# EAGLE design WMF Ambient SmartPot (EAGLE 9.5.1)
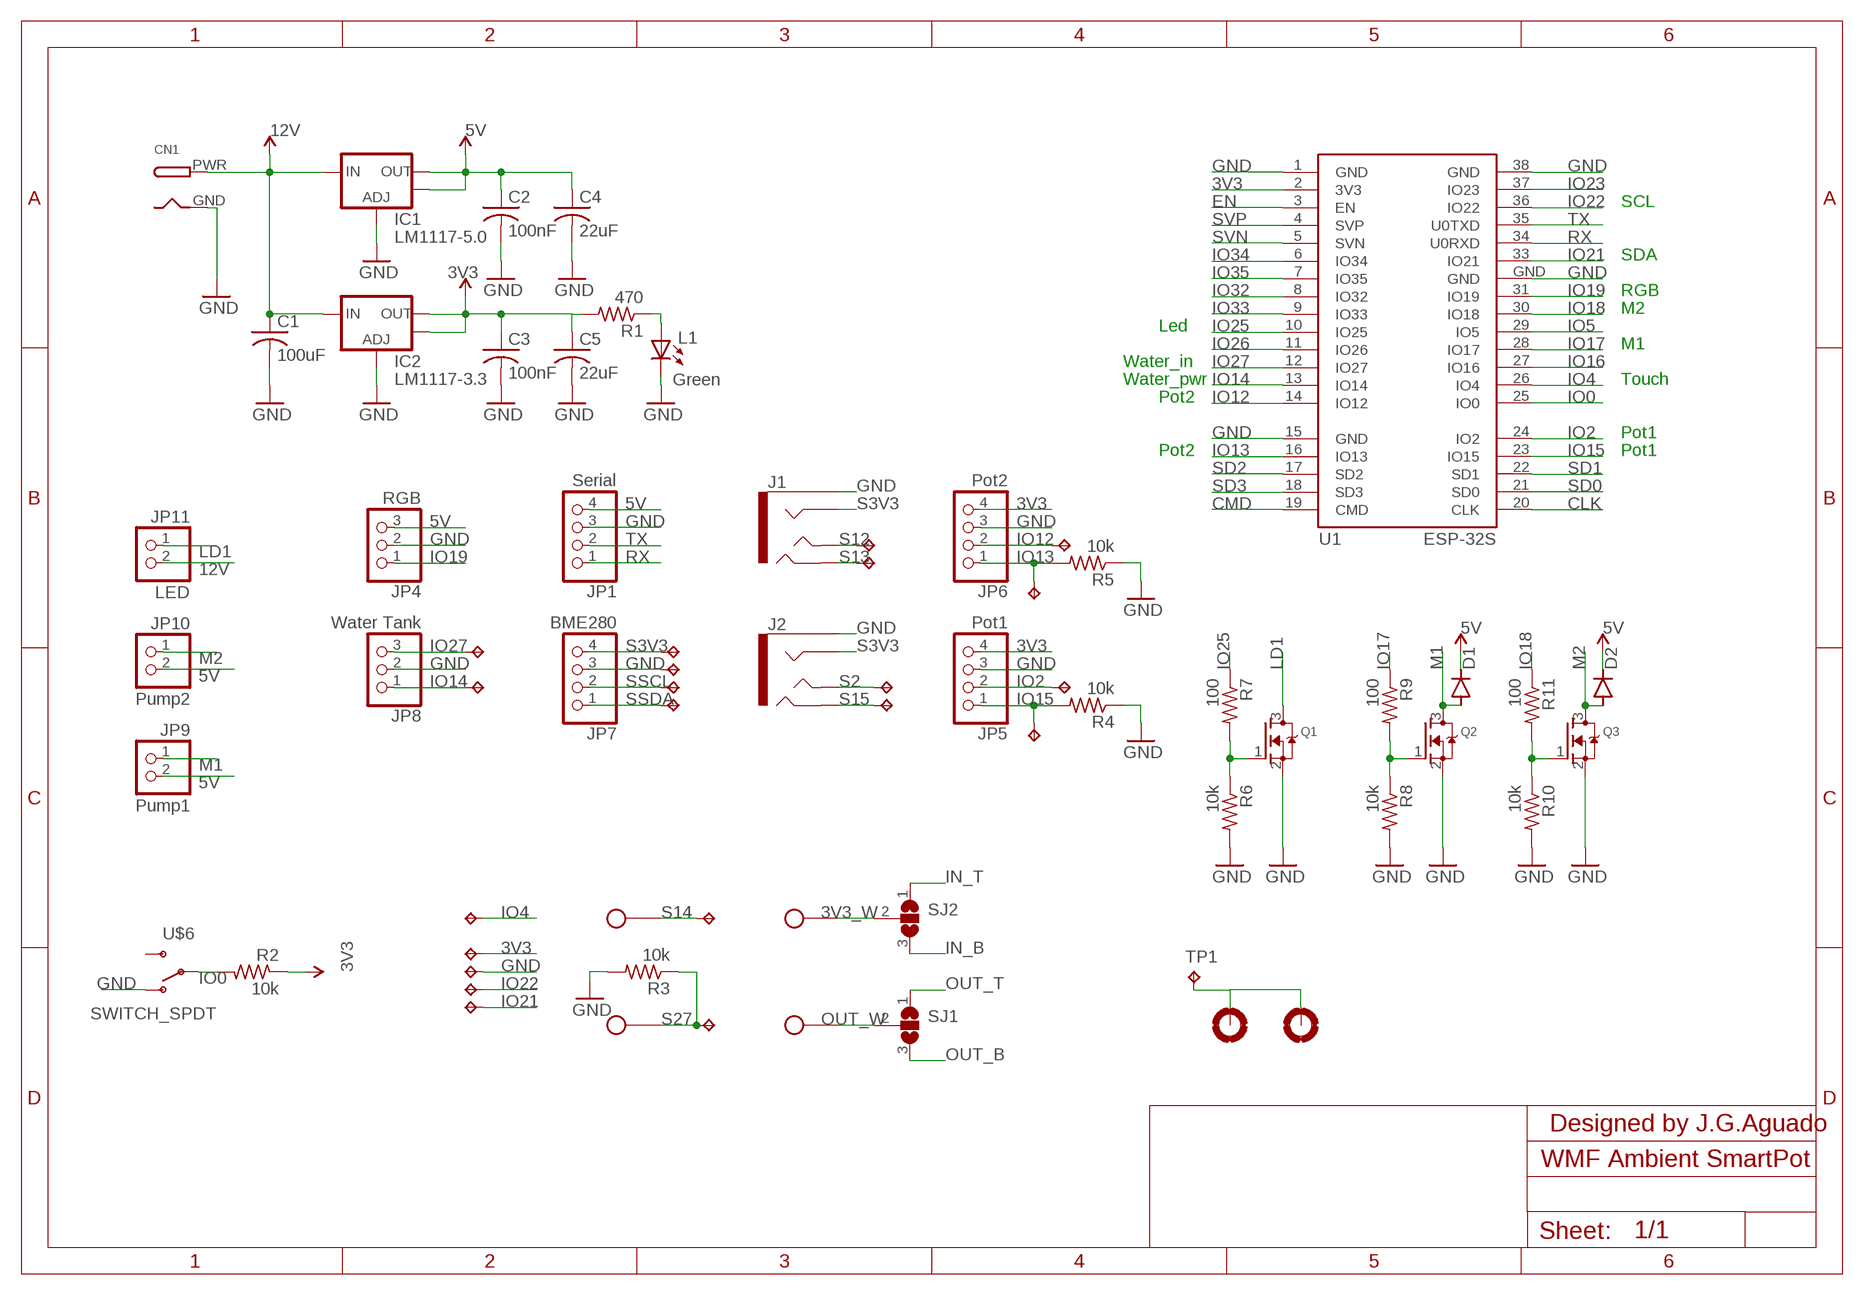
[diagram p0: schematic, sheet 1]

## Parts
C1  100uF  C1206  [1206]
C2  100nF  C1206  [1206]
C3  100nF  C1206  [1206]
C4  22uF  C1206  [1206]
C5  22uF  C1206  [1206]
CN1  DCBARRELPTH  [DCJACK_2MM_PTH]
D1  CGRM4002-G  [SOD-123_MINI-SMA]
D2  CGRM4002-G  [SOD-123_MINI-SMA]
H1  MOUNT-PAD-ROUND2.8  [2,8-PAD]
H2  MOUNT-PAD-ROUND2.8  [2,8-PAD]
IC1  LM1117-5.0  V_REG_LM1117SOT223  [SOT223]
IC2  LM1117-3.3  V_REG_LM1117SOT223  [SOT223]
J1  AUDIO_JACK_TRRSSMD_RA  [AUDIO_JACK_3.5MM_TRRS_SMD_RA]
J2  AUDIO_JACK_TRRSSMD_RA  [AUDIO_JACK_3.5MM_TRRS_SMD_RA]
JP1  Serial  PINHD-1X4  [1X04]
JP4  RGB  PINHD-1X3  [1X03]
JP5  Pot1  PINHD-1X4  [1X04]
JP6  Pot2  PINHD-1X4  [1X04]
JP7  BME280  PINHD-1X4  [1X04]
JP8  Water Tank  PINHD-1X3  [1X03]
JP9  Pump1  PINHD-1X2  [1X02]
JP10  Pump2  PINHD-1X2  [1X02]
JP11  LED  PINHD-1X2  [1X02]
L1  Green  LED1206  [LED1206]
Q1  MOSFET-NREFLOW  [SOT23]
Q2  MOSFET-NREFLOW  [SOT23]
Q3  MOSFET-NREFLOW  [SOT23]
R1  470  R1206  [1206]
R2  10k  R1206  [1206]
R3  10k  R1206  [1206]
R4  10k  R1206  [1206]
R5  10k  R1206  [1206]
R6  10k  R1206  [1206]
R7  100  R1206  [1206]
R8  10k  R1206  [1206]
R9  100  R1206  [1206]
R10  10k  R1206  [1206]
R11  100  R1206  [1206]
SJ1  SJ2W  [SJ_2]
SJ2  SJ2W  [SJ_2]
TP1  TPTP15SQ  [TP15SQ]
TP2  TPTP15SQ  [TP15SQ]
TP3  TPTP15SQ  [TP15SQ]
TP4  TPTP15SQ  [TP15SQ]
TP5  TPTP15SQ  [TP15SQ]
TP6  TPTP15SQ  [TP15SQ]
TP7  TPTP15SQ  [TP15SQ]
TP8  TPTP15SQ  [TP15SQ]
TP9  TPTP15SQ  [TP15SQ]
TP10  TPTP15SQ  [TP15SQ]
TP11  TPTP15SQ  [TP15SQ]
TP12  TPTP15SQ  [TP15SQ]
TP13  TPTP15SQ  [TP15SQ]
TP14  TPTP15SQ  [TP15SQ]
TP15  TPTP15SQ  [TP15SQ]
TP16  TPTP15SQ  [TP15SQ]
TP17  TPTP15SQ  [TP15SQ]
TP18  TPTP15SQ  [TP15SQ]
TP19  TPTP15SQ  [TP15SQ]
TP20  TPTP15SQ  [TP15SQ]
TP21  TPTP15SQ  [TP15SQ]
TP23  TPTP15SQ  [TP15SQ]
U1  ESP-32S  [ESP-32S]
U$2  OVAL_3MM_HOLE  [OVAL_HOLE]
U$3  OVAL_3MM_HOLE  [OVAL_HOLE]
U$4  OVAL_3MM_HOLE  [OVAL_HOLE]
U$5  OVAL_3MM_HOLE  [OVAL_HOLE]
U$6  SWITCH_SPDT  [KPS-1290]

## Nets
3V3: C3.1 C5.1 IC2.2(OUT) IC2.4(OUT) JP5.4 JP6.4 R1.2 R2.1 TP2.TP U1.2(3V3) ; supply symbol labelled VCC
3V3_W: SJ2.2 U$4.P$2
5V: C2.1 C4.1 D1.C D2.C IC1.2(OUT) IC1.4(OUT) JP1.4 JP4.3 JP9.2 JP10.2 ; supply symbol labelled VCC
12V: C1.1 CN1.PWR IC1.3(IN) IC2.3(IN) JP11.2 ; supply symbol labelled VCC
CLK: U1.20(CLK)
CMD: U1.19(CMD)
EN: U1.3(EN)
GND: C1.2 C2.2 C3.2 C4.2 C5.2 CN1.GND IC1.1(ADJ) IC2.1(ADJ) J1.EARTH J2.EARTH JP1.3 JP4.2 JP5.3 JP6.3 JP7.3 JP8.2 L1.C Q1.2(S) Q2.2(S) Q3.2(S) R3.2 R4.1 R5.1 R6.2 R8.2 R10.2 TP3.TP TP7.TP U1.1(GND) U1.15(GND) U1.38(GND) U1.GND U$6.O
IN_B: SJ2.3
IN_T: SJ2.1
IO0: R2.2 U1.25(IO0) U$6.P
IO2: JP5.2 TP15.TP U1.24(IO2)
IO4: TP10.TP U1.26(IO4)
IO5: U1.29(IO5)
IO12: JP6.2 TP14.TP U1.14(IO12)
IO13: JP6.1 R5.2 TP18.TP U1.16(IO13)
IO14: JP8.1 TP13.TP U1.13(IO14)
IO15: JP5.1 R4.2 TP19.TP U1.23(IO15)
IO16: U1.27(IO16)
IO17: R9.1 U1.28(IO17)
IO18: R11.1 U1.30(IO18)
IO19: JP4.1 U1.31(IO19)
IO21: TP5.TP U1.33(IO21)
IO22: TP4.TP U1.36(IO22)
IO23: U1.37(IO23)
IO25: R7.1 U1.10(IO25)
IO26: U1.11(IO26)
IO27: JP8.3 TP11.TP U1.12(IO27)
IO32: U1.8(IO32)
IO33: U1.9(IO33)
IO34: U1.6(IO34)
IO35: U1.7(IO35)
LD1: JP11.1 Q1.3(D)
M1: D1.A JP9.1 Q2.3(D)
M2: D2.A JP10.1 Q3.3(D)
N$1: L1.A R1.1
N$6: Q1.1(G) R6.1 R7.2
N$7: Q2.1(G) R8.1 R9.2
N$8: Q3.1(G) R10.1 R11.2
OUT_B: SJ1.3
OUT_T: SJ1.1
OUT_W: SJ1.2 U$5.P$2
RX: JP1.1 U1.34(U0RXD)
S2: J2.TIP TP20.TP
S3V3: J1.RING1 J2.RING1 JP7.4 TP6.TP
S12: J1.TIP TP16.TP
S13: J1.RING2 TP17.TP
S14: TP12.TP U$2.P$2
S15: J2.RING2 TP21.TP
S27: R3.1 TP23.TP U$3.P$2
SD0: U1.21(SD0)
SD1: U1.22(SD1)
SD2: U1.17(SD2)
SD3: U1.18(SD3)
SSCL: JP7.2 TP8.TP
SSDA: JP7.1 TP9.TP
SVN: U1.5(SVN)
SVP: U1.4(SVP)
TOUCH: H1.B2,8(MOUNT) H2.B2,8(MOUNT) TP1.TP
TX: JP1.2 U1.35(U0TXD)
Unconnected: U$6.S

## Notes on the sheet
- SCL
- SDA
- RGB
- M2
- Led
- M1
- Water_in
- Water_pwr | Touch
- Pot2
- Pot1
- Pot2 | Pot1
- Designed by J.G.Aguado

## Library data of the parts
C1-C5 = SpaceDIY_passive_components:C1206
CN1 = SpaceDIY_connectors:DCBARREL: 2.0mm DC Barrel Jack DCJACK_2MM_PTH - Through Hole Jack (4UConnector: 05537)
D1 D2 = diode:CGRM400*-G: Molded plasitc,JEDEC SOD-123/Mini SMA Source: Comchip CGRM4001-G.pdf
H1 H2 = holes:MOUNT-PAD-ROUND: MOUNTING PAD, round
IC1 IC2 = SparkFun:V_REG_LM1117: Voltage Regulator LM1117 Standard adjustable voltage regulator but in SMD form. Spark Fun Electronics SKU : COM-00595
J1 J2 = SparkFun-Connectors:AUDIO_JACK_TRRS: Audio Jack - 3.5mm TRRS (SMD) This is a 3.5mm TRRS SMD audio jack. TRRS connectors are the audio-style connectors that you see on some phones, MP3 players and development boards. TRRS stands for “tip, ring, ring, sleeve,” which reflects that this has three conductors and a ground. SparkFun Products: Audio Jack <https://www.sparkfun.com/products/12639> mbed Starter Kit <https://www.sparkfun.com/products/12968> SparkFun TRRS 3.5mm Jack Breakout <https://www.sparkfun.com/products/11570>; PROD_ID: CONN-10676; SF_ID: PRT-12639
JP1 JP5-JP7 = SpaceDIY_connectors:PINHD-1X4: PIN HEADER
JP4 JP8 = SpaceDIY_connectors:PINHD-1X3: PIN HEADER
JP9-JP11 = SpaceDIY_connectors:PINHD-1X2: PIN HEADER
L1 = SpaceDIY_passive_components:LED1206
Q1-Q3 = adafruit:MOSFET-N: N-Channel Mosfet 2N7002E - 60V 260mA SOT23 [Digikey: 2N7002ET1GOSTR-ND] - REEL BSH103 - 30V 850mA SOT23 [Digikey: 568-5013-1-ND]
R1-R11 = SpaceDIY_passive_components:R1206
SJ1 SJ2 = jumper:SJ2W: SMD solder JUMPER
TP1-TP21 TP23 = testpad:TP: Test pad
U1 = esp32:ESP-32S: Ai-Thinker ESP-32S
U$2-U$5 = SpaceDIY_connectors:OVAL_3MM_HOLE
U$6 = SparkFun-Retired:SWITCH_SPDT: SWCH-10651 Side-actuated SPDT slide switch, as used on the Arduino Pro; PROD_ID: SWCH-10651

## Board
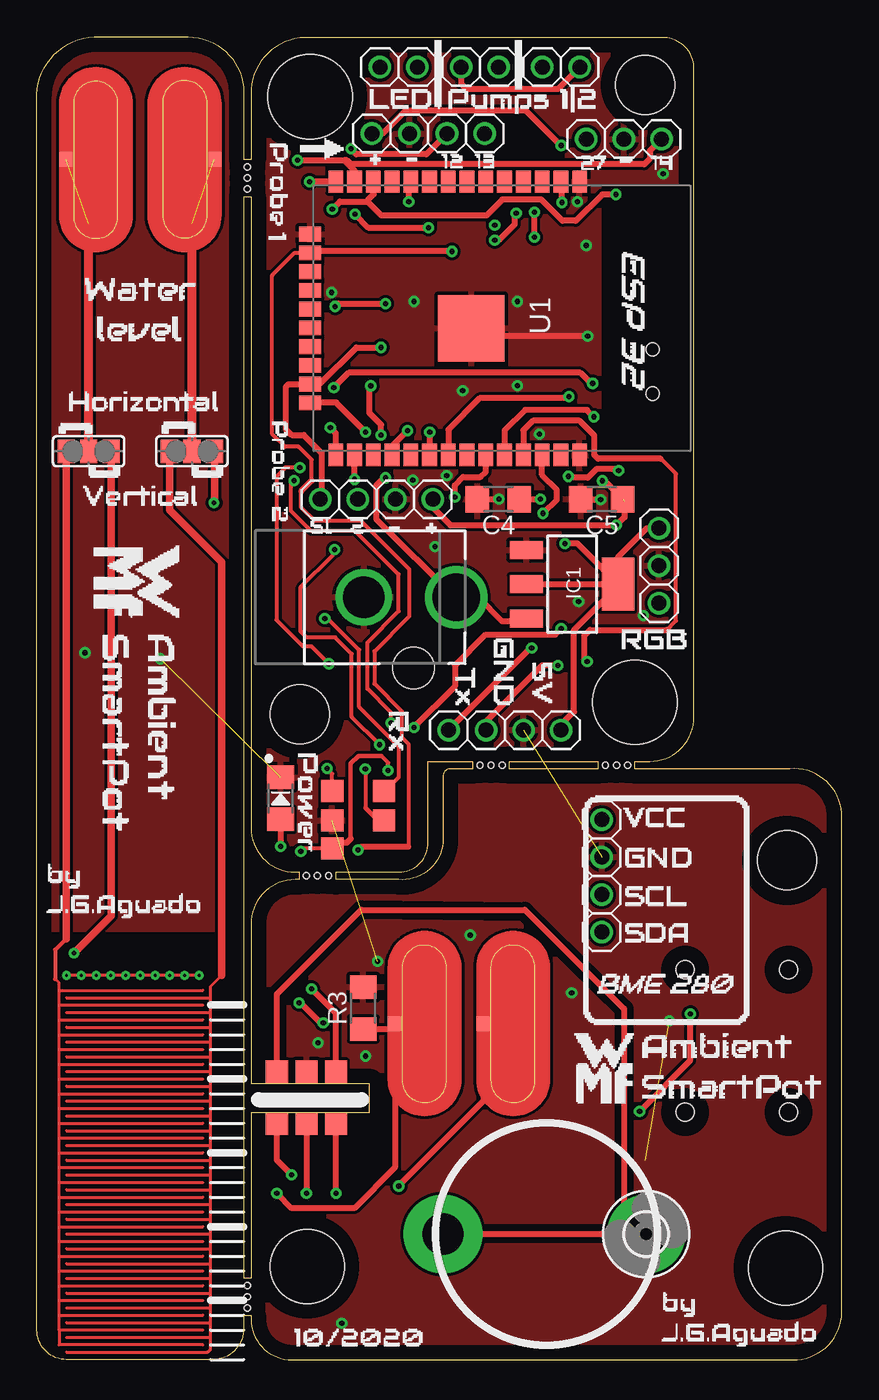
[diagram p1: board, top side]
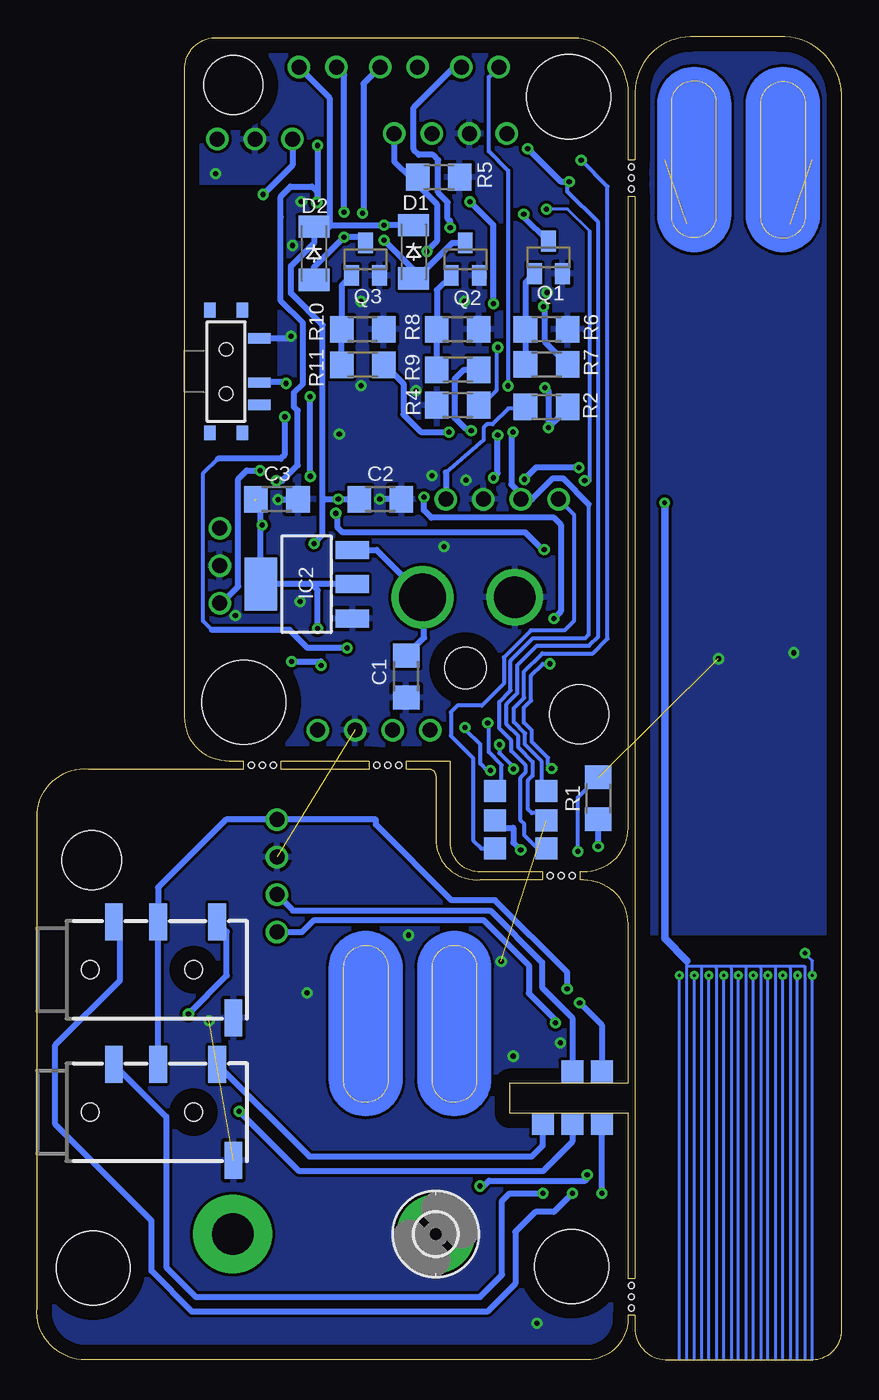
[diagram p2: board, bottom side, seen from below]

Size 54.51 x 89.55 mm. Coordinates in mm from the lower left corner, seen from the top.
Outline: 18.5,89.5 arc90 14.5,86 14.5,81.25 14,81.25 14,85.8 arc90 10.25,89.55 4.25,89.55 arc90 0,85.68 0,2 arc90 2,0 11.75,0 arc90 14,1.95 14,3 14.5,3 arc90 17,0 51.5,0 arc90 54.5,3.5 54.5,37 arc90 51,40 40.5,40 40.5,40.5 41.5,40.5 arc90 44.5,43.5 44.5,87.5 arc90 42.3,89.5 18.5,89.5
Outline: 14,78.75 14.5,78.75 14.5,36 arc90 17.5,33 17.75,33 17.75,32.5 17.5,32.5 arc90 14.5,29.5 14.5,18.7 22.5,18.7 22.5,16.7 14.5,16.7 14.5,5.5 14,5.5 14,78.75
Outline: 20.25,33 24.5,33 arc90 26.5,35 26.5,40.5 29.5,40.5 29.5,40 28,40 arc90 27.5,39.5 27.5,35 arc-90 24.5,32.5 20.25,32.5 20.25,33
Outline: 32,40.5 38,40.5 38,40 32,40 32,40.5
Copper layers (1*16): Top 0.035mm / dielectric 1.5mm / Bottom 0.035mm
Design rules "PCBway": minimum track width 6mil, minimum drill 0.3mm, track to track 0.205mm, track to pad 0.205mm, pad to pad 0.205mm, via to via 0.205mm, smd to smd 8mil, copper to edge 40mil, drill to drill 8mil, minimum pad ring 10mil, minimum via ring 8mil, stop-mask expansion 4mil, vias tented up to drill 25mil, thermal gap 10mil
Holes 0.4 mm at 30,40.25 30.75,40.25 31.5,40.25 38.5,40.25 39.25,40.25 40,40.25 19.75,32.75 18.25,32.75 19,32.75 14.25,3.5 14.25,4.25 14.25,5 14.25,79.25 14.25,80 14.25,80.75
Holes 5.7 mm at 18.5,85.5 40.5,44.5
Holes 5 mm at 18.3,6.3 50.7,6.2
Holes 4 mm at 50.8,33.8 17.8,43.7 41.2,86.3
tRestrict: 7 lines

### Footprints (pad centres in the part's own frame; a part is rotated, then mirrored left to right if it is on the bottom)
1206 = smd 1.6 x 1.803: 1 -1.422,0; 2 1.422,0
DCJACK_2MM_PTH = drill 2.8: GND 0,7.35 | drill 3.2: PWR 0,13.6 | hole 2.8: 4.8,10.7
SOD-123_MINI-SMA = smd 1.5 x 2.1: A 1.8,0; C -1.8,0
2,8-PAD = drill 2.8 pad 5.334: B2,8 0,0
SOT223 = smd 1.219 x 2.235: 1 -2.311,-3.099; 2 0,-3.099; 3 2.311,-3.099 | smd 3.6 x 2.2: 4 0,3.099
AUDIO_JACK_3.5MM_TRRS_SMD_RA = smd 1.2 x 2.5: EARTH 11.3,-3.25; RING1 6.2,3.25; RING2 3.2,3.25; TIP 10.2,3.25 | hole 1.2: 1.6,0; 8.6,0
1X04 = drill 1.016: 1 -3.81,0; 2 -1.27,0; 3 1.27,0; 4 3.81,0
1X03 = drill 1.016: 1 -2.54,0; 2 0,0; 3 2.54,0
1X02 = drill 1.016: 1 -1.27,0; 2 1.27,0
LED1206 = smd 1.6 x 1.803: A -1.422,0; C 1.422,0
SOT23 = smd 1 x 1.4: 1 -0.95,-1.1; 2 0.95,-1.1; 3 0,1.1
SJ_2 = smd 1.168 x 1.6: 1 -1.524,0; 2 0,0; 3 1.524,0
TP15SQ = smd 1.5 x 1.5: TP 0,0
ESP-32S = smd 1.5 x 1: 1 -9.25,7; 2 -9.25,5.73; 3 -9.25,4.46; 4 -9.25,3.19; 5 -9.25,1.92; 6 -9.25,0.65; 7 -9.25,-0.62; 8 -9.25,-1.89; 9 -9.25,-3.16; 10 -9.25,-4.43; 11 -9.25,-5.7; 12 -9.25,-6.97; 13 -9.25,-8.24; 14 -9.25,-9.51; 25 9.25,-9.51; 26 9.25,-8.24; 27 9.25,-6.97; 28 9.25,-5.7; 29 9.25,-4.43; 30 9.25,-3.16; 31 9.25,-1.89; 32 9.25,-0.62; 33 9.25,0.65; 34 9.25,1.92; 35 9.25,3.19; 36 9.25,4.46; 37 9.25,5.73; 38 9.25,7 | smd 1 x 1.5: 15 -5.7,-11.25; 16 -4.43,-11.25; 17 -3.16,-11.25; 18 -1.89,-11.25; 19 -0.62,-11.25; 20 0.65,-11.25; 21 1.92,-11.25; 22 3.19,-11.25; 23 4.46,-11.25; 24 5.73,-11.25 | smd 4.5 x 4.5: GND 0.68,-0.33
OVAL_HOLE = smd 1 x 1: P$2 -2,0
KPS-1290 = smd 0.7 x 1.5: O -2.25,2.25; P 0.75,2.25; S 2.25,2.25 | smd 1 x 0.8: P$1 -4.15,1.1; P$2 -4.15,-1.1; P$3 4.15,-1.1; P$4 4.15,1.1 | hole 0.9: -1.5,0; 1.5,0

### Placement (x,y rotation side)
C1  29.5,46.25 270 bottom
C2  31.25,58.25 0 bottom
C3  38.25,58.25 0 bottom
C4  31.25,58.25 180 top
C5  38.25,58.25 180 top
CN1  14.8,51.62 270 top
D1  29,75 270 bottom
D2  35.75,74.9 270 bottom
H1  27.5,8.5 180 bottom
H2  41.25,8.5 180 top
IC1  36.25,52.5 270 top
IC2  36.25,52.5 90 bottom
J1  52.5,26.4 0 bottom
J2  52.5,16.75 0 bottom
JP1  31.68,42.62 0 top
JP4  42.13,53.75 90 top
JP5  23,58.25 0 top
JP6  26.5,83 180 top
JP7  38.25,32.75 90 top
JP8  39.75,82.64 180 top
JP9  30,87.5 180 top
JP10  35.5,87.5 0 top
JP11  24.5,87.5 180 top
L1  16.5,38 90 top
Q1  19.87,74.62 0 bottom
Q2  25.5,74.5 0 bottom
Q3  32.25,74.5 0 bottom
R1  16.5,38 90 bottom
R2  20,64.5 0 bottom
R3  22.1,23.8 90 top
R4  26,64.62 0 bottom
R5  27.3,80.05 180 bottom
R6  20,69.75 0 bottom
R7  20,67.37 180 bottom
R8  26,69.75 0 bottom
R9  26,67.02 180 bottom
R10  32.45,69.75 0 bottom
R11  32.45,67.35 180 bottom
SJ1  10.5,61.5 0 top
SJ2  3.5,61.5 0 top
TP1  16.25,19.5 90 top
TP2  20,34.6 90 top
TP3  20,36.5 90 top
TP4  23.5,36.5 90 top
TP5  23.5,38.5 90 top
TP6  20.25,19.5 90 top
TP7  18.25,19.5 90 top
TP8  18.25,19.5 90 bottom
TP9  16.25,19.5 90 bottom
TP10  20,38.5 90 top
TP11  23.5,38.5 0 bottom
TP12  16.25,15.95 0 top
TP13  20,38.5 0 bottom
TP14  20,36.5 0 bottom
TP15  20,34.6 0 bottom
TP16  18.25,15.95 0 bottom
TP17  18.25,15.95 0 top
TP18  23.5,36.5 0 bottom
TP19  23.5,34.6 0 bottom
TP20  20.25,15.95 0 bottom
TP21  20.25,15.95 0 top
TP23  16.25,15.95 0 bottom
U1  29.75,70.5 270 top
U$2  32.25,22.75 0 top
U$3  26.25,22.75 0 top
U$4  4,81.25 0 top
U$5  10,81.25 180 top
U$6  41.7,66.9 270 bottom

### Tracks (layer width: path | path; a pad name or v marks a point on that pad's centre or on a via)
3V3  (via drill 0.35)  (1 unrouted)
  Top 0.254: v23.79,39.89 23.79,40.42 23.34,40.87 | TP2.TP 18.08,34.6 v17.88,34.4
  Top 0.305: 21.25,35.25 21.25,40.35 21.77,40.87 23.34,40.87
  Top 0.406: JP5.4 26.81,57.69 28,56.5 v39.25,56.5 39.79,57.04 39.79,58.14 C5.1 38.42,59.5 v38.3,59.5 | TP2.TP 20.4,35 21,35 21.25,35.25 | 25.53,42.91 v25.53,42.8 25.51,42.8 28.3,45.59 28.3,47 30.38,49.09 35.08,49.09 v35.5,49.5 | U1.2 35.48,80 35.55,79.93 v35.55,78.35 | JP6.4 23.4,83 25,84.6 33.1,84.6 v35.5,82.2
  Bottom 0.254: v25.53,42.8 25.53,42.68 24.49,41.64 24.49,40.35 24.02,39.89 v23.79,39.89 | 26.81,60.07 24.27,62.27 24.27,63.1 24.03,63.34 23.66,63.34 22.59,64.4 21.52,64.4 | v17.88,34.4 17.88,38.05 R1.2
  Bottom 0.406: IC2.2 35.9,52.5 | 35.9,52.5 IC2.4 39.35,57.93 C5.1 | v35.5,49.5 35.5,52.1 35.9,52.5 | v38.3,59.5 37.9,59.5 36.85,60.55 36.85,64.26 37.1,64.5 37.1,65.46 36.5,66.06 36.5,70.2 37.99,71.7 37.99,77.37 38,77.38 38,78.75 37.33,79.42 35.91,79.42 35.55,79.06 v35.55,78.35 35.6,78.4 35.5,78.5 v35.5,82.2 | R2.1 21.52,64.4 | 26.81,60.07 JP5.4
3V3_W  (1 unrouted)
  Top 0.61: SJ2.2 3.5,76.88
5V  (via drill 0.35)
  Top 0.406: IC1.2 IC1.4 | IC1.4 39.35,54.35 41.29,56.29 JP4.3 | IC1.4 36.6,55.25 v35.75,55.25 | IC1.4 39.35,52.39 36.37,49.41 36.37,43.87 35.49,43 JP1.4 | JP9.2 28.73,86.37 29.06,86.04 35.31,86.04 JP10.2 | C4.1 v34.1,58.25
  Bottom 0.406: v35.75,55.25 35.15,55.85 35.15,58.25 | 35.15,58.25 v34.1,58.25 C4.1 | D1.C 29.01,76.82 v31,76.82 34.7,76.82 | 35.15,58.25 35.15,70.05 37.3,72.2 37.3,74.04 35.75,75.59 D2.C 34.7,76.7 34.7,76.82 | JP10.2 34.7,85.43 34.7,76.82
12V  (via drill 0.35)
  Top 0.406: IC1.3 32.96,50 31.5,50 29.89,51.62 CN1.PWR 28.28,51.62 22.98,56.91 22.98,59.19 23.5,59.7 v23.6,59.7 | v23.31,62.6 23.31,63.3 22.51,64.1 22.51,65.73 v22.61,65.93
  Bottom 0.254: JP11.2 23.9,86.83 23.9,81.8 22.6,80.5 v22.61,65.93
  Bottom 0.406: IC2.3 31.5,54.82 28.4,51.71 | C1.1 28.29,48.89 28.29,51.6 28.4,51.71 | v23.6,59.7 23.31,60 v23.31,62.6 | 28.4,51.71 CN1.PWR
CAP
  pour Top: 11.75,0.75 arc-90 11.5,0.5
GND  (via drill 0.35)  (4 unrouted)
  Top 0.406: v37.3,69.3 29.94,69.3 U1.GND | C4.2 v31.29,58.25 | 36.95,58.25 36.98,58.22 v38.18,58.22
  Bottom 0.406: U$6.O 37.45,69.15 v37.3,69.3 | C4.2 v31.29,58.25 31.2,58.17 31.2,58.1 | v38.18,58.22 36.98,58.22 36.95,58.25
  other vias: 19.05,21.45 28.83,65.62 32.55,65.95 25.55,71.65 32.55,71.65 19.95,72.25 27.75,59.85 25.45,59.55 26.95,55.05 41.07,50.39 34.03,62.67 20.65,2.45 22.25,20.55 8.35,47.45 3.25,47.85 36.69,51.34 42.4,80.3 37.19,75.44 36.6,78.4 23.07,26.97 29.34,28.74 36.21,24.84 42.84,22.94
  pour Top: -0.25,89.8 14.25,89.8 14.25,29 -0.25,29
  pour Top: 14.5,89.5 44.5,89.5 44.5,40.5 26.75,40.5 26.75,33 14.5,33
  pour Top: 14.5,32.75 25,32.75 arc90 27.25,35 27.25,40 54.75,40 54.75,-0.25 14.5,-0.25
  pour Bottom: 54.75,40 27.25,40 27.25,35 arc-90 25,32.75 14.5,32.75 14.5,-0.25 54.75,-0.25
  pour Bottom: 14.5,33 26.75,33 26.75,40.5 44.5,40.5 44.5,89.5 14.5,89.5
  pour Bottom: 14.45,89.6 -0.05,89.6 -0.05,28.8 14.45,28.8
IN_B  (via drill 0.2, 0.3)
  Top 0.203: v11,26 v10,26 v9,26 v8,26 v7,26 v6,26 v5,26 v4,26 v3,26 v2,26
  Top 0.508: SJ2.3 5.02,30.03 v2.5,27.5
  Bottom 0.203: 2,0 v2,26 2,27 v2.5,27.5 | 3,0 v3,26 | 4,0 v4,26 | 5,0 v5,26 | 6,0 v6,26 | 7,0 v7,26 | 8,0 v8,26 | 9,0 v9,26 | 10,0 v10,26 | 11,0 v11,26
IN_T
  Top 0.2: 11.25,2 1.5,2 | 1.5,2 1.5,3 | 1.5,3 11.25,3 | 1.5,3 1.5,4 | 1.5,4 1.5,5 | 1.5,5 1.5,6 | 1.5,6 1.5,7 | 1.5,7 1.5,8 | 1.5,8 1.5,9 | 1.5,4 11.25,4 | 1.5,2 1.5,1 11.25,1 | 1.5,5 11.25,5 | 1.5,6 11.25,6 | 1.5,7 11.25,7 | 1.5,8 11.25,8 | 1.5,9 11.25,9 | 1.5,9 1.5,10 | 1.5,10 1.5,11 | 1.5,11 1.5,12 | 1.5,12 1.5,13 | 1.5,13 1.5,14 | 1.5,10 11.25,10 | 1.5,11 11.25,11 | 1.5,12 11.25,12 | 1.5,13 11.25,13 | 1.5,14 11.25,14 | 1.5,14 1.5,15 | 1.5,15 1.5,16 | 1.5,16 1.5,17 | 1.5,17 1.5,18 | 1.5,18 1.5,19 | 1.5,15 11.25,15 | 1.5,16 11.25,16 | 1.5,17 11.25,17 | 1.5,18 11.25,18 | 1.5,19 11.25,19 | 1.5,19 1.5,20 | 1.5,20 1.5,21 | 1.5,21 1.5,22 | 1.5,22 1.5,23 | 1.5,23 1.5,24 | 1.5,24 1.5,25 | 1.5,25 1.5,25.25 | 1.5,20 11.25,20 | 1.5,21 11.25,21 | 1.5,22 11.25,22 | 1.5,23 11.25,23 | 1.5,24 11.25,24 | 1.5,25 11.25,25
  Top 0.203: 1.5,25.25 1.5,25.5 1.24,25.77
  Top 0.254: 1.98,28.48 1.24,27.74 1.24,25.77
  Top 0.508: SJ2.1 1.98,28.48
IO0  (via drill 0.35)
  Top 0.406: v19.86,63.09 20.24,62.72 U1.25 | v37.64,66.1 37.52,66.1 36.8,66.82 21.12,66.82 v20.1,65.8
  Bottom 0.406: R2.2 18.58,64.38 v19.86,63.09 19.86,65.57 v20.1,65.8 | U$6.P 39.38,66.22 37.76,66.22 v37.64,66.1
IO2  (via drill 0.35)
  Top 0.406: U1.24 18.53,64.8 20.26,64.8 v22.26,62.8
  Bottom 0.254: 20.15,34.75 20.75,34.75 21.5,35.5 21.5,36.25 21.76,36.52 21.76,39.4 21.43,39.74 21.43,40.25 22.37,41.2 22.37,41.91 23.2,42.74 23.2,44.54 22.43,45.31 22.43,47.32 20.91,48.85 17.38,48.85 17.15,49.08 17.15,57.92
  Bottom 0.406: TP15.TP 20.15,34.75 | 17.15,57.92 18.9,59.67 19.55,59.67 20.97,58.25 JP5.2 21.73,58.61 22.38,59.26 22.38,62.69 v22.26,62.8
IO4  (via drill 0.35)
  Top 0.254: TP10.TP 20,39.67 v19.65,40.02 | v19.77,47.11 18.58,48.3 17.99,48.3 16.22,50.08 16.22,59.79 16.84,60.4 v17.8,60.4
  Top 0.406: v21.5,59.6 U1.26
  Bottom 0.254: v19.65,40.02 19.9,40.27 19.9,40.74 21,41.83 21,42.6 21.53,43.13 21.53,44.14 21.05,44.62 21.05,46.31 20.26,47.11 v19.77,47.11
  Bottom 0.406: v17.8,60.4 20.7,60.4 v21.5,59.6
IO12  (via drill 0.35)
  Top 0.406: U1.14 v18.47,79.75 | JP6.2 26.37,81.6 21.63,81.6 21.27,81.96 v21.27,81.99
  Bottom 0.254: 20.5,37 21,37 21.25,37.25 21.25,39.24 20.94,39.55 20.94,40.47 21.91,41.45 21.91,42.22 22.71,43.02 22.71,44.38 21.97,45.12 21.97,47.02 20.66,48.33 17.12,48.33 16.5,48.95 16.5,77 18.59,79.09 18.59,79.75
  Bottom 0.406: TP14.TP 20.5,37 | v21.27,81.99 19.03,79.75 18.59,79.75 v18.47,79.75
IO13  (via drill 0.35)
  Top 0.254: U1.16 17.46,74.93 15.94,73.42 15.94,62.66 16.8,61.8 17.72,61.8 18.6,60.92 18.6,59.5 | 17.9,58.8 17.9,57.7 18.8,56.8 21.92,56.8 25.21,53.51 25.21,50.32 22.85,47.95 22.85,45.76 24.7,43.91 24.7,42.15 25.16,41.69 25.16,34.72
  Top 0.406: 25.16,34.72 24.5,34.72 21.97,34.72 v21.75,34.5 | 17.9,58.8 18.6,59.5 | v28.1,75.03 18.6,75.03 U1.16
  Bottom 0.406: TP18.TP 23,36 22.25,36 22.25,35 v21.75,34.5 | JP6.1 30.31,81.11 29.25,80.05 | 29.25,80.05 27.42,78.22 27.42,75.72 v28.1,75.03 | R5.2 29.25,80.05
IO14  (via drill 0.35)
  Top 0.406: U1.13 21.51,80.49 20.8,81.2 | v17.65,81.2 20.8,81.2 | JP8.1 41.5,81.85 41.5,81.3 41.12,80.93 21.28,80.93 21,81.2 20.8,81.2
  Bottom 0.254: TP13.TP 20.36,38.86 20.36,40.55 21.46,41.64 21.46,42.41 22.21,43.16 22.21,44.11 21.51,44.81 21.51,46.6 20.29,47.82 16.87,47.82 15.87,48.82 15.87,79.43 v17.65,81.2
IO15  (via drill 0.35)
  Top 0.406: JP5.1 19.28,58.34 19.28,61.39 18.07,62.6 17.25,62.6 16.86,63 16.86,65.86 17.04,66.04 U1.23 19.14,66.04 21.63,68.53 v23.3,68.53
  Bottom 0.254: JP5.1 18.16,57.22 18.16,50 18.78,49.38 21.05,49.38 22.89,47.54 22.89,45.76 24.38,44.28 26.04,44.28 26.48,43.84 26.48,42.22 24.98,40.73 24.98,35.16 24.42,34.6 TP19.TP | 23.28,68.43 23.4,68.31 23.4,65.62 24.4,64.62
  Bottom 0.406: v23.3,68.53 23.28,68.52 23.28,68.43 | 24.4,64.62 R4.2
IO17  (via drill 0.35)
  Top 0.406: U1.28 24.05,61.85 v25.1,62.9
  Bottom 0.406: v25.1,62.9 25.2,63 25.46,63 26.2,63.74 26.2,66.4 25.59,67.02 R9.1
IO18  (via drill 0.35)
  Top 0.406: v26.6,62.8 U1.30
  Bottom 0.406: R11.1 30.58,66.9 30.51,66.9 29.69,66.09 29.69,64 28.5,62.8 v26.6,62.8
IO19  (via drill 0.35)
  Top 0.406: v39.4,60.2 39.3,60.31 37.9,60.31 37.3,59.7 36,59.7 v36,59.8 | v36.02,65.2 36.02,65.09 29.98,65.09 27.86,62.96 U1.31
  Bottom 0.406: JP4.1 42.01,51.21 40.88,52.35 40.88,59.62 40.3,60.2 v39.4,60.2 | v36.02,65.2 36,65.19 v36,59.8
IO21  (via drill 0.35)
  Top 0.254: TP5.TP 23.57,38.5 24.52,39.45 24.52,41.48 21.82,44.18 21.82,48.05 19.69,50.18 v19.5,50.18
  Top 0.406: v28.3,58.4 28.3,59.19 28.87,59.75 30.05,59.75 30.4,60.1 U1.33
  Bottom 0.406: v19.5,50.18 19.02,50.65 19.02,56.53 19.5,57 27.8,57 28.3,57.5 v28.3,58.4
IO22  (via drill 0.35)
  Top 0.254: v22.23,40 22.25,39.98 22.25,37.39 | v23.19,41.63 v23.19,41.64 21.32,43.51 21.32,47.78 20.19,48.9 18.27,48.9 17.87,49.3 17.87,52.31 20.04,54.48 20.04,54.85 v20.16,54.85
  Top 0.305: 23.1,36.5 22.25,37.35 22.25,37.39
  Top 0.406: TP4.TP 23.1,36.5 | v34.27,57.3 34.21,57.36 34.3,57.3 35.2,58.2 35.2,58.9 34.21,59.89 U1.36
  Bottom 0.254: v23.19,41.63 23.19,41.07 22.23,40.11
  Bottom 0.305: v22.23,40 22.23,40.11
  Bottom 0.406: v20.16,54.85 20.28,54.85 21.44,56 33.8,56 34.17,56.37 34.17,57.2 v34.27,57.3
IO25  (via drill 0.35)
  Top 0.406: v20.2,71.3 20.4,71.5 v23.6,71.5 | v25.18,78.4 25.18,79.62 U1.10
  Bottom 0.406: R7.1 20.1,68.89 20.1,71.3 v20.2,71.3 | v23.6,71.5 23.6,76.82 v25.18,78.4
IO27  (via drill 0.35)
  Top 0.254: v17.42,59.51 17.18,59.27 17.18,57.5 18.58,56.11 21.55,56.11 24.5,53.16 24.5,50.67 22.37,48.54 22.37,45.42 23.98,43.81 v23.98,43.1
  Top 0.406: U1.12 22.8,79.73 22.8,78.9 22.4,78.5 22.4,78.4 | v39.2,78.89 38.28,78.89 36.5,77.1 35.6,77.1 34.16,78.55 31.52,78.55 30.45,77.47 23.34,77.47 22.4,78.4 | v20.01,77.9 20.51,78.4 22.4,78.4
  Bottom 0.203: 17.07,76.39 18.58,77.9 v20.01,77.9
  Bottom 0.254: TP11.TP 23.04,38.97 23.04,40.25 23.91,41.13 23.91,43.03 v23.98,43.1 | 17.07,59.51 17.07,76.39 | v17.42,59.51 17.07,59.51 | 17.07,59.51
  Bottom 0.406: JP8.3 37.21,80.88 v39.2,78.89
LD1  (via drill 0.35)
  Top 0.406: v21.55,77.54 22.44,76.65 v26.52,76.65
  Bottom 0.406: v21.55,77.54 21.55,77.4 Q1.3 | JP11.1 26.26,87.5 29,84.76 29,81.92 28.65,81.57 27.7,81.57 27.35,81.21 27.35,79.01 26.69,78.36 26.69,77.24 26.52,77.07 v26.52,76.65
M1  (via drill 0.35)
  Top 0.406: v32.46,77.63 32.34,77.51 32.34,76.84 31.3,75.8 v31,75.8
  Bottom 0.406: JP9.1 32.4,86.37 32.4,77.68 v32.46,77.63 | v31,75.8 29,73.8 D1.A 28.8,73.2 26.4,75.6 Q2.3
M2  (via drill 0.35)
  Top 0.406: v33.7,76 v33.7,77.69
  Bottom 0.406: Q3.3 32.65,76 v33.7,76 35.75,73.95 D2.A | v33.7,77.69 33.7,86.97 JP10.1
N$1  (via drill 0.35)
  Top 0.406: L1.A v16.5,34.75
  Bottom 0.406: v16.5,34.75 L1.A
N$6
  Bottom 0.406: Q1.1 21.42,72.92 R6.1 R7.2
N$7
  Bottom 0.406: Q2.1 27.42,72.43 R8.1 R9.2
N$8
  Bottom 0.406: Q3.1 33.87,72.73 R10.1 R11.2
N$19
  Bottom 0.203: 3.5,26.5 3.5,0
N$22
  Bottom 0.203: 4.5,26.5 4.5,0
N$24
  Bottom 0.203: 5.5,26.5 5.5,0
N$26
  Bottom 0.203: 6.5,26.5 6.5,0
N$28
  Bottom 0.203: 7.5,26.5 7.5,0
N$30
  Bottom 0.203: 8.5,26.5 8.5,0
N$32
  Bottom 0.203: 9.5,26.5 9.5,0
OUT_B  (via drill 0.3)
  Top 0.508: SJ1.3 12.02,58.03 v12,58
  Bottom 0.203: 2.5,0 2.5,26.62 10.5,26.62 | 10.5,0 10.5,26.62 | 10.5,26.62 10.5,27
  Bottom 0.508: v12,58 12,28.5 10.5,27
OUT_T
  Top 0.2: 11.75,3.5 11.75,4.5 | 11.75,4.5 11.75,5.5 | 11.75,5.5 11.75,6.5 | 11.75,6.5 11.75,7.5 | 11.75,7.5 11.75,8.5 | 11.75,8.5 11.75,9.5 | 11.75,9.5 11.75,10.5 | 2,3.5 11.75,3.5 | 2,0.5 11.5,0.5 arc90 11.75,0.75 11.75,1.5 | 2,2.5 11.75,2.5 | 11.75,2.5 11.75,3.5 | 11.75,1.5 11.75,2.5 | 2,1.5 11.75,1.5 | 2,4.5 11.75,4.5 | 2,5.5 11.75,5.5 | 2,6.5 11.75,6.5 | 2,7.5 11.75,7.5 | 2,8.5 11.75,8.5 | 2,9.5 11.75,9.5 | 11.75,10.5 11.75,11.5 | 11.75,11.5 11.75,12.5 | 11.75,12.5 11.75,13.5 | 11.75,13.5 11.75,14.5 | 11.75,14.5 11.75,15.5 | 2,10.5 11.75,10.5 | 2,11.5 11.75,11.5 | 2,12.5 11.75,12.5 | 2,13.5 11.75,13.5 | 2,14.5 11.75,14.5 | 11.75,15.5 11.75,16.5 | 11.75,16.5 11.75,17.5 | 11.75,17.5 11.75,18.5 | 11.75,18.5 11.75,19.5 | 11.75,19.5 11.75,20.5 | 2,15.5 11.75,15.5 | 2,16.5 11.75,16.5 | 2,17.5 11.75,17.5 | 2,18.5 11.75,18.5 | 2,19.5 11.75,19.5 | 11.75,20.5 11.75,21.5 | 11.75,21.5 11.75,22.5 | 11.75,22.5 11.75,23.5 | 11.75,23.5 11.75,24.5 | 11.75,24.5 11.75,25 | 2,20.5 11.75,20.5 | 2,21.5 11.75,21.5 | 2,22.5 11.75,22.5 | 2,23.5 11.75,23.5 | 2,24.5 11.75,24.5
  Top 0.203: 11.75,25 11.75,25.25 12.5,26
  Top 0.508: 12.5,26 12.5,54 8.98,57.53 SJ1.1
OUT_W  (1 unrouted)
  Top 0.61: SJ1.2 10.5,76.91
RX  (via drill 0.35)
  Top 0.406: U1.34 31.67,62.92 33.05,64.3 37.25,64.3 v37.72,63.84 | v33.5,48.19 33.44,48.19 JP1.1
  Bottom 0.254: 42.25,61 43.28,59.98 43.28,50.03 42.65,49.4
  Bottom 0.406: v37.72,63.84 37.75,63.8 37.75,61.25 38,61 42.25,61 | 42.65,49.4 37.4,49.4 36.18,48.19 v33.5,48.19
S2
  Bottom 0.406: J2.TIP 36.05,13.75 21,13.75 20.25,14.5 TP20.TP
S3V3  (via drill 0.35)
  Top 0.406: TP6.TP 20.25,23.45 v18.6,25.1
  Bottom 0.406: v18.6,25.1 18.6,26.2 23.49,31.09 26.43,31.09 31.56,36.23 31.56,36.56 JP7.4 41.69,36.56 46.3,31.95 J1.RING1 J2.RING1
S12  (via drill 0.35)
  Top 0.406: v40.82,16.82 44.25,20.25 v44.25,23.41
  Bottom 0.406: TP16.TP 18.25,14.75 20.25,12.75 36.75,12.75 v40.82,16.82 | v44.25,23.41 41.66,26 41.66,28.97 42.3,29.61 J1.TIP
S13  (via drill 0.35)
  Top 0.406: TP17.TP v18.25,11.25
  Bottom 0.406: v18.25,11.25 19.5,10 20.75,10 22.11,8.65 22.11,5.15 24,3.25 44,3.25 46.75,6 46.75,9.41 53.26,15.93 53.26,21.3 48.87,25.68 48.87,28.75 49.3,29.18 J1.RING2
S14  (via drill 0.35)
  Top 0.406: U$2.P$2 30.25,17.5 v24.5,11.75 | v17.25,12.5 16.25,13.5 TP12.TP
  Bottom 0.406: v24.5,11.75 24.25,11.75 23.88,12.12 17.38,12.12 17.25,12.25 v17.25,12.5
S15  (via drill 0.35)
  Top 0.406: v20.25,11.25 TP21.TP
  Bottom 0.406: J2.RING2 45.75,16.45 45.75,6.25 43.75,4.25 24.5,4.25 23,5.75 23,10.75 22.5,11.25 v20.25,11.25
S27  (via drill 0.35)
  Top 0.406: U$3.P$2 24.25,22.3 | 24.25,22.3 24.25,13 21.5,10.25 17.25,10.25 v16.25,11.25 | R3.1 24.17,22.38 24.25,22.3
  Bottom 0.406: v16.25,11.25 TP23.TP
SSCL
  Bottom 0.406: JP7.2 37.18,30.41 23.81,30.41 20.3,26.9 20.3,25.2 18.25,23.15 TP8.TP
SSDA  (via drill 0.35)
  Top 0.406: v19.4,22.8 19.2,22.8 17.8,24.2 v17.75,24.15
  Bottom 0.406: JP7.1 36.56,28.94 35.74,29.77 24.26,29.77 21.2,26.7 21.2,24.8 19.4,23 v19.4,22.8 | v17.75,24.15 16.25,22.65 TP9.TP
TOUCH
  Top 0.406: TP1.TP 16.25,24.75 21.95,30.46 33.05,30.46 39.75,23.75 39.75,10 H2.B2,8 H1.B2,8
TX  (via drill 0.35)
  Top 0.254: 42.65,49.4 43.28,50.03 43.28,59.98 42.25,61
  Top 0.406: 42.25,61 38,61 37.75,61.25 37.75,62.57 36.74,63.57 33.59,63.57 32.94,62.92 U1.35 | 42.65,49.4 37.45,49.4 37.06,49 37.06,47.47 v37.26,47.27 | v35.28,47 34.21,47 30.41,43.2 JP1.2
  Bottom 0.406: v37.26,47.27 35.28,47.27 v35.28,47